# Altium schematic sheet STM.SchDoc
size B; SheetNumber: 3; SheetTotal: 7
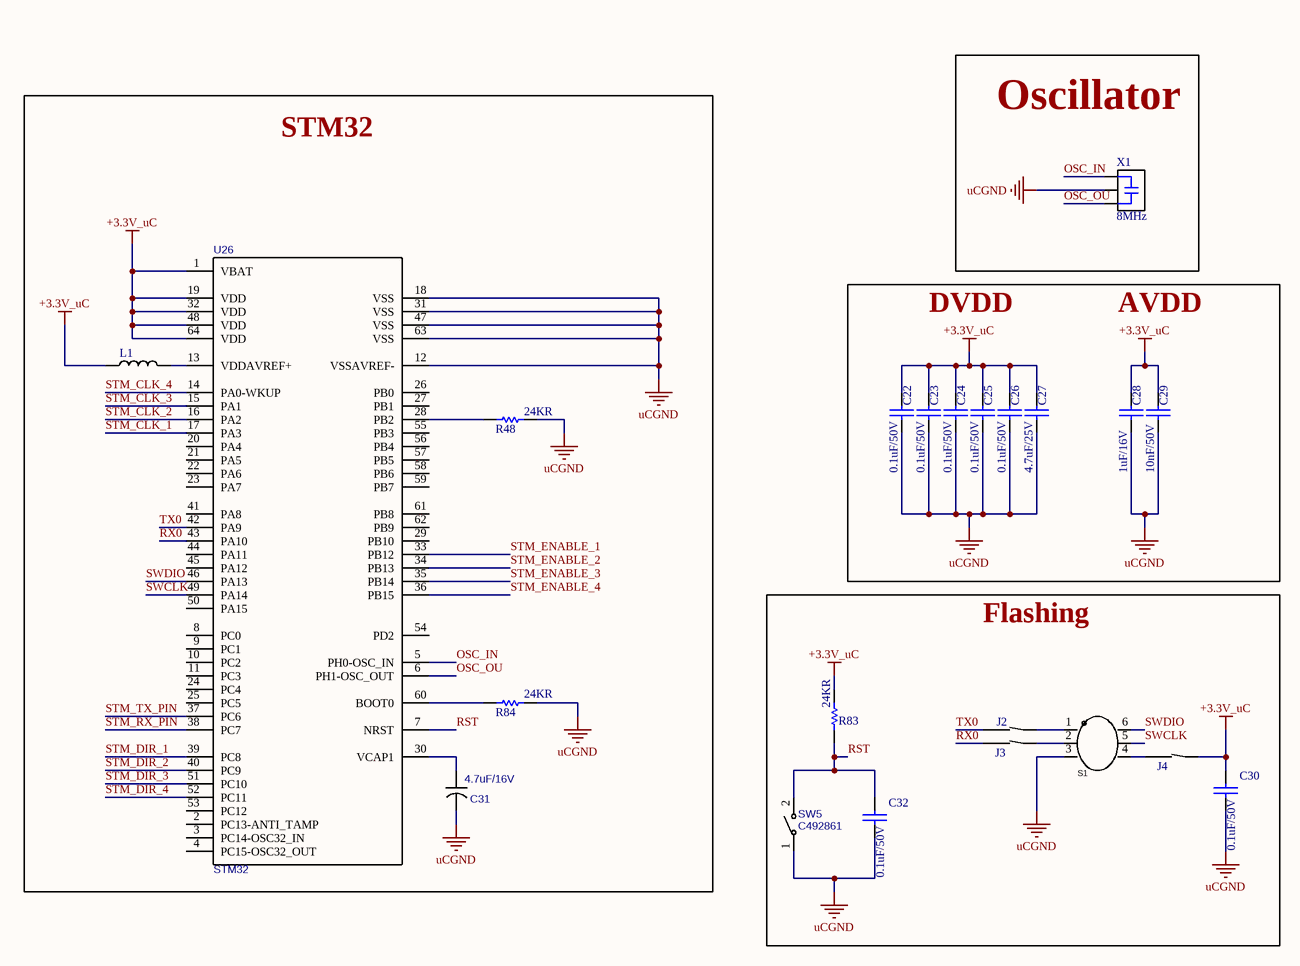
[diagram p0: STM.SchDoc]

## Parts
C22  0.1uF/50V  [PCBComponent_1]
C23  0.1uF/50V  [PCBComponent_1]
C24  0.1uF/50V  [PCBComponent_1]
C25  0.1uF/50V  [PCBComponent_1]
C26  0.1uF/50V  [PCBComponent_1]
C27  4.7uF/25V  [PCBComponent_1]
C28  1uF/16V  [PCBComponent_1]
C29  10nF/50V  [PCBComponent_1]
C30  0.1uF/50V  [PCBComponent_1]
C31  4.7uF/16V  [CASE-B_3528]
C32  0.1uF/50V  [PCBComponent_1]
J2  Jumper  [Jumper]  (value not drawn)  (no BOM)
J3  Jumper  [Jumper]  (value not drawn)  (no BOM)
J4  Jumper  [Jumper]  (value not drawn)  (no BOM)
L1  CMI201209X100KT  [INDC2012X06N]  (value not drawn)
R48  24KR  [RESC1608X06N]
R83  24KR  [RESC1608X06N]
R84  24KR  [RESC1608X06N]
S1  STM Debug  [STM_Debug]  (value not drawn)  (no BOM)
SW5  C492861  [SW-SMD_L4.0-W3.0-LS4.8]
U26  STM32  [LQFP-64_L10.0-W10.0-P0.50-LS12.0-BL]
X1  8MHz  [SMD3213-3P]

## Blocks framed on the sheet
Oscillator: X1
STM32: C31 L1 R48 R84 U26
Flashing: C30 C32 J2-J4 R83 S1 SW5

## Nets
+3.3V_uC: C22.2 C23.2 C24.2 C25.2 C26.2 C27.2 C28.2 C29.2 C30.2 J4.2 L1.1 R83.1 U26.1(VBAT) U26.19(VDD) U26.32(VDD) U26.48(VDD) U26.64(VDD)
uCGND: C22.1 C23.1 C24.1 C25.1 C26.1 C27.1 C28.1 C29.1 C30.1 C31.2 C32.1 R48.1 R84.1 S1.3 SW5.1 U26.12(VSSAVREF-) U26.18(VSS) U26.31(VSS) U26.47(VSS) U26.63(VSS) X1.2
OSC_IN: U26.5(PH0-OSC_IN) X1.1
OSC_OU: U26.6(PH1-OSC_OUT) X1.3
RST: C32.2 R83.2 SW5.2 U26.7(NRST)
RX0: J3.1 U26.43(PA10)
STM_CLK_1: U26.17(PA3)
STM_CLK_2: U26.16(PA2)
STM_CLK_3: U26.15(PA1)
STM_CLK_4: U26.14(PA0-WKUP)
STM_DIR_1: U26.39(PC8)
STM_DIR_2: U26.40(PC9)
STM_DIR_3: U26.51(PC10)
STM_DIR_4: U26.52(PC11)
STM_ENABLE_1: U26.33(PB12)
STM_ENABLE_2: U26.34(PB13)
STM_ENABLE_3: U26.35(PB14)
STM_ENABLE_4: U26.36(PB15)
STM_RX_PIN: U26.38(PC7)
STM_TX_PIN: U26.37(PC6)
SWCLK: S1.5 U26.49(PA14)
SWDIO: S1.6 U26.46(PA13)
TX0: J2.1 U26.42(PA9)
NetC31_1: C31.1 U26.30(VCAP1)
NetJ2_2: J2.2 S1.1
NetJ3_2: J3.2 S1.2
NetJ4_1: J4.1 S1.4
NetL1_2: L1.2 U26.13(VDDAVREF+)
NetR48_2: R48.2 U26.28(PB2)
NetR84_2: R84.2 U26.60(BOOT0)

Not connected (* = marked no-connect by the designer): U26 2(PC13-ANTI_TAMP) 3(PC14-OSC32_IN) 4(PC15-OSC32_OUT) 8(PC0) 9(PC1) 10(PC2) 11(PC3) 20(PA4) 21(PA5) 22(PA6) 23(PA7) 24(PC4) 25(PC5) 26(PB0) 27(PB1) 29(PB10) 41(PA8) 44(PA11) 45(PA12) 50(PA15) 53(PC12) 54(PD2) 55(PB3) 56(PB4) 57(PB5) 58(PB6) 59(PB7) 61(PB8) 62(PB9)

## Notes on the sheet
- DVDD
- AVDD

## Library data of the parts
C22-C26 C30 C32 = 0603 Capacitor: C1591; Created By: NourAldin; DataSheet Link: https://eu.mouser.com/datasheet/2/400/lcc_automotive_general_en-843974.pdf; Mouser Link: https://eu.mouser.com/ProductDetail/TDK/CGA1A2X7R1H331M030BA?qs=sGAEpiMZZMs0AnBnWHyRQL8L3bkL%252bvtyS9XpSB1mk7rVV5K8%252bbxEeg%3d%3d
C27 = 0603 Capacitor: C69335; Created By: NourAldin; DataSheet Link: https://eu.mouser.com/datasheet/2/400/lcc_automotive_general_en-843974.pdf; Mouser Link: https://eu.mouser.com/ProductDetail/TDK/CGA1A2X7R1H331M030BA?qs=sGAEpiMZZMs0AnBnWHyRQL8L3bkL%252bvtyS9XpSB1mk7rVV5K8%252bbxEeg%3d%3d
C28 = 0603 Capacitor: C1592; Created By: NourAldin; DataSheet Link: https://eu.mouser.com/datasheet/2/400/lcc_automotive_general_en-843974.pdf; Mouser Link: https://eu.mouser.com/ProductDetail/TDK/CGA1A2X7R1H331M030BA?qs=sGAEpiMZZMs0AnBnWHyRQL8L3bkL%252bvtyS9XpSB1mk7rVV5K8%252bbxEeg%3d%3d
C29 = 0603 Capacitor: C100042; Created By: NourAldin; DataSheet Link: https://eu.mouser.com/datasheet/2/400/lcc_automotive_general_en-843974.pdf; Mouser Link: https://eu.mouser.com/ProductDetail/TDK/CGA1A2X7R1H331M030BA?qs=sGAEpiMZZMs0AnBnWHyRQL8L3bkL%252bvtyS9XpSB1mk7rVV5K8%252bbxEeg%3d%3d
C31 = 3528  Tantalum Cap: C7206; Manufacturer: Kyocera AVX; Manufacturer Part: TAJR106K006RNJ; nameAlias: Value; Contributor: LCSC; Supplier: LCSC; Supplier Part: C132274; JLCPCB Part Class: Extended Part; spicePre: C; spiceSymbolName: TAJR106K006RNJ
L1 = 0805 SMD INDUCTOR: C99366; Created By: NourAldin
R48 R83 R84 = 0603 Resistor: C2930081; Created By: NourAldin; Mouser Link: https://eu.mouser.com/ProductDetail/Panasonic/ERA-3AHD180V?qs=sGAEpiMZZMvdGkrng054t5mej2KPdPuFSlDBd1tSiF0%3d; DataSheet Link: https://eu.mouser.com/datasheet/2/315/AOA0000C307-1149632.pdf
S1 = STM Debug: Wurth Elektronik 490107670612; Manufacturer: XKB Connection(中国星坤); Symbol: X4621WVS-2X03I-C40D64; Add into BOM: yes; Pin Structure: 2x3P; Pitch: 2mm; Circluar Pins/Square Pins: Square Pins; Current Rating (Max): 2A; Voltage Rating (Max): 250V; Soldering Temperature(Max): 260℃; Device: X4621WVS-2x03I-C40D64; LCSC Part Name: 2x3P 间距:2mm 方针 直插; Supplier Part: C917608; Manufacturer Part: X4621WVS-2x03I-C40D64; Supplier Footprint: SMD,P=2mm; JLCPCB Part Class: Extended Part; Datasheet: https://atta.szlcsc.com/upload/public/pdf/source/20211011/BBC0D112400A54BA7413419DECD38CC2.pdf; Supplier: LCSC; Convert to PCB: yes; Row Spacing: 2mm; Mounting Type: Straight; Number of Rows: 双排; Number of Pins: 6P; Length of Mating Pin: 4mm; Insulation Height: 2mm; Length of End Connection Pin: 6.4mm; Contact Plating: Gold; Operating Temperature Range: -40℃~+105℃; Color: Black
SW5 = tact switch: Manufacturer: Yuandi(元迪); Manufacturer Part: TS-1071AS-A1B3-D4; Contributor: LCSC; Supplier: LCSC; Supplier Part: C492861; JLCPCB Part Class: Extended Part; spicePre: S; spiceSymbolName: TS-1071AS-A1B3-D4
U26 = STM32F401RCT6: C74524; Manufacturer: ST(意法半导体); Supplier: LCSC; Manufacturer Part: STM32F401RCT6; Supplier Part: C74524; JLCPCB Part Class: Extended Part; spicePre: U; spiceSymbolName: STM32F401RCT6
X1 = CSTCE16M0V53-R0: C907975; Manufacturer: Murata; Frequency: 16MHz; Frequency Stability: 0.3%; Frequency Tolerance: 0.5%; Capacitance: 15pF; Impedance: 40R; Supplier 1: Digi-Key; Manufacturer Part Number: CSTCE16M0V53-R0; RoHS: Yes; Category: Resonators; Mount: Surface Mount; Case/Package: SMD/SMT; Min Operating Temperature: -40°C; Max Operating Temperature: 85°C; Packaging: Cut Tape; Series: CERALOCK® CSTNE; RoHS Compliant: Yes; ComponentLink1URL: https://www.murata.com/en/products/productdata/8801162231838/SPEC-CSTNE16M0V530000R0.pdf?src-supplier=Digi-Key; ComponentLink1Description: https://www.murata.com/en/products/productdata/8801162231838/SPEC-CSTNE16M0V530000R0.pdf?src-supplier=Digi-Key; LCSC Link: https://www.lcsc.com/product-detail/Ceramic-Resonators_Murata-Electronics-CSTCE16M0V53-R0_C32180.html; Supplier Part Number 1: 490-1198-2-ND; Supplier Part Number 2: C32180